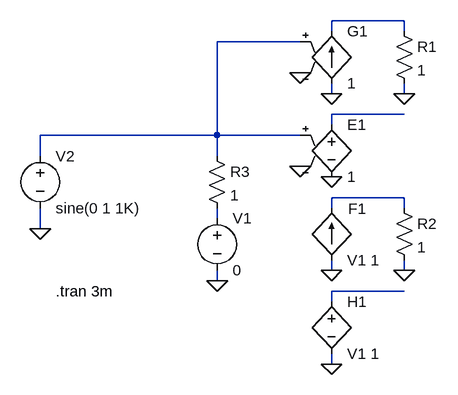
[diagram p0: schematic Linear_dependent_sources_E_F_G_H.asc]
Linear_dependent_sources_E_F_G_H.asc, the LTspice schematic file:
Version 4
SHEET 1 880 692
WIRE -272 304 -272 272
WIRE -272 416 -272 384
WIRE 0 272 -272 272
WIRE 0 272 0 128
WIRE 0 304 0 272
WIRE 0 400 0 384
WIRE 0 496 0 480
WIRE 128 128 0 128
WIRE 128 272 0 272
WIRE 176 112 176 96
WIRE 176 208 176 192
WIRE 176 256 176 240
WIRE 176 384 176 368
WIRE 176 480 176 464
WIRE 176 528 176 512
WIRE 176 624 176 608
WIRE 288 96 176 96
WIRE 288 112 288 96
WIRE 288 208 288 192
WIRE 288 240 176 240
WIRE 288 368 176 368
WIRE 288 384 288 368
WIRE 288 480 288 464
WIRE 288 512 176 512
FLAG 288 208 0
FLAG 176 208 0
FLAG 128 176 0
FLAG 176 336 0
FLAG 128 320 0
FLAG 288 480 0
FLAG 176 480 0
FLAG 176 624 0
FLAG -272 416 0
FLAG 0 496 0
SYMBOL g 176 96 R0
SYMATTR InstName G1
SYMATTR Value 1
SYMBOL e 176 240 R0
SYMATTR InstName E1
SYMATTR Value 1
SYMBOL f 176 464 M180
WINDOW 0 26 79 Left 0
WINDOW 3 24 0 Left 0
SYMATTR InstName F1
SYMATTR Value V1 1
SYMBOL h 176 512 R0
SYMATTR InstName H1
SYMATTR Value V1 1
SYMBOL res 272 96 R0
SYMATTR InstName R1
SYMATTR Value 1
SYMBOL res 272 368 R0
SYMATTR InstName R2
SYMATTR Value 1
SYMBOL voltage 0 384 R0
SYMATTR InstName V1
SYMATTR Value 0
SYMBOL res -16 288 R0
SYMATTR InstName R3
SYMATTR Value 1
SYMBOL voltage -272 288 R0
SYMATTR InstName V2
SYMATTR Value sine(0 1 1K)
TEXT -248 512 Left 0 !.tran 3m

The netlist it stands for:
* Linear_dependent_sources_E_F_G_H.asc
G1 0 N003 N001 0 1
E1 N004 0 N001 0 1
F1 0 N005 V1 1
H1 N006 0 V1 1
R1 N003 0 1
R2 N005 0 1
V1 N002 0 0
R3 N001 N002 1
V2 N001 0 sine(0 1 1K)
.tran 3m
.backanno
.end